# EAGLE design pico_1v4 (EAGLE 7.4.0)
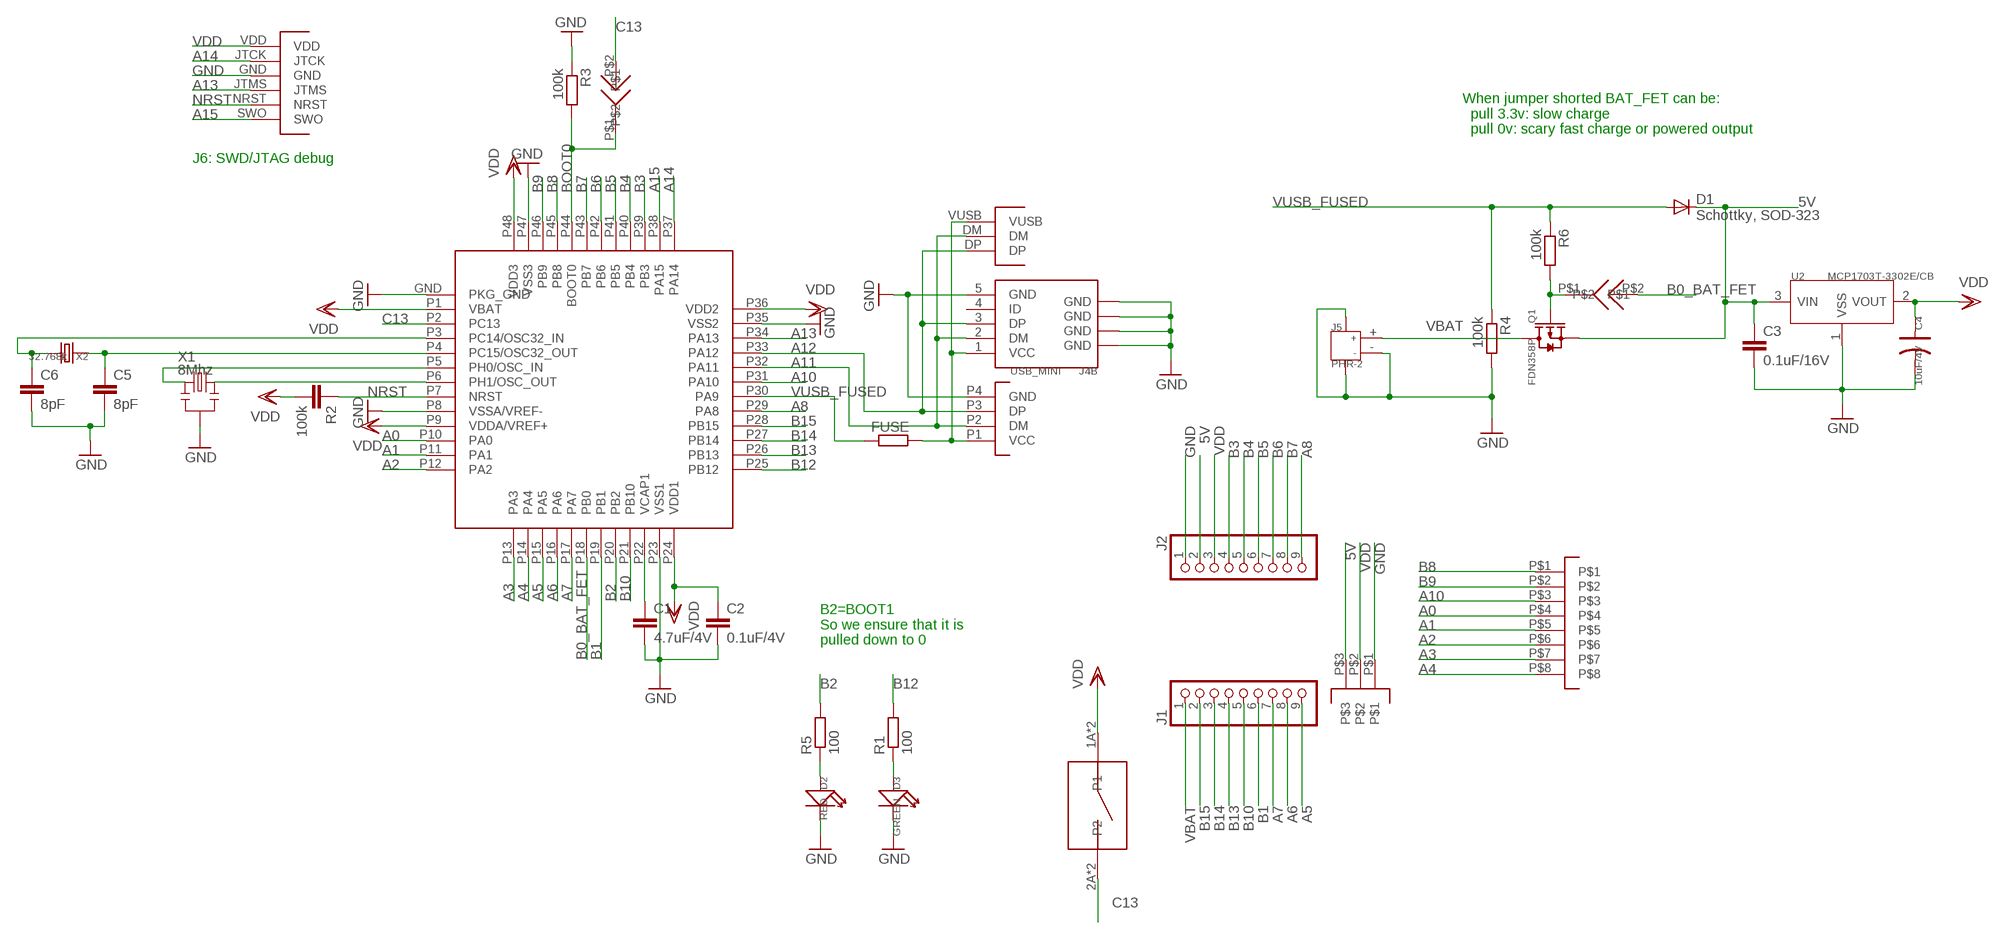
[diagram p0: schematic, sheet 1]

## Parts
B1  KMR421NG  [KMR421NG]
C1  4.7uF/4V  C0402  [C0402]
C2  0.1uF/4V  C0402  [C0402]
C3  0.1uF/16V  C0402  [C0402]
C4  10uF/4V  C-POLAR-A  [AVX-A]
C5  8pF  C0402  [C0402]
C6  8pF  C0402  [C0402]
D1  Schottky, SOD-323  DIODE-SOD323-W  [SOD323-W]
D2  RED  LED'0402'  [LED-0402]
D3  GREEN  LED'0402'  [LED-0402]
FUSE  R-EU_R0603  [R0603]
J1  PINHEAD9  [PINHEAD9]
J2  PINHEAD9  [PINHEAD9]
J3  SOLDERJUMPER  [SOLDERJUMPER]
J4A  USB_TYPE_A_ONBOARD  [USB_TYPEA_ONBOARD]
J4B  USB_MINI  [USB_MINI]
J5  PHR-2  JACK-JST-2P-SMD-PW'2.0'  [JST-SMD-2.0-90D]
J6  CON-SWD  [CON-SWD]
J7  SOLDERJUMPER  [SOLDERJUMPER]
J8  PINHEAD-1.27-8X1  [PINHEAD-1.27-8X1]
J9  PINHEAD-1.27-3X1  [PINHEAD-1.27-3X1]
Q1  FDN358P  MOSFET-P-0440210P1  [SOT23]
R1  100  R0402  [R0402]
R2  100k  C0402  [C0402]
R3  100k  R0402  [R0402]
R4  100k  R0402  [R0402]
R5  100  R0402  [R0402]
R6  100k  R0402  [R0402]
U1  STM32F401CDU6  STM32F401RCH  [UFQFPN48]
U2  MCP1703T-3302E/CB  XC6206  [SOT23]
U$1  USB  [USB]
X1  8Mhz  CRYSTAL-RESONATOR'SMD'  [3P-SMD-3.6X1.3]
X2  32.768k  CRYSTAL'NX2012SA'  [2P-SMD-2.05X1.2]

## Nets
5V: C3.1 D1.C J2.2 J9.P$3 Q1.2(S) U2.3(VIN)
A0: J8.P$4 U1.P10(PA0)
A1: J8.P$5 U1.P11(PA1)
A2: J8.P$6 U1.P12(PA2)
A3: J8.P$7 U1.P13(PA3)
A4: J8.P$8 U1.P14(PA4)
A5: J1.9 U1.P15(PA5)
A6: J1.8 U1.P16(PA6)
A7: J1.7 U1.P17(PA7)
A8: J2.9 U1.P29(PA8)
A10: J8.P$3 U1.P31(PA10)
A11: J4A.P2(DM) J4B.2(DM) U1.P32(PA11) U$1.DM
A12: J4A.P3(DP) J4B.3(DP) U1.P33(PA12) U$1.DP
A13: J6.JTMS U1.P34(PA13)
A14: J6.JTCK U1.P37(PA14)
A15: J6.SWO U1.P38(PA15)
B0_BAT_FET: J3.P$2 U1.P18(PB0)
B1: J1.6 U1.P19(PB1)
B2: R5.2 U1.P20(PB2)
B3: J2.4 U1.P39(PB3)
B4: J2.5 U1.P40(PB4)
B5: J2.6 U1.P41(PB5)
B6: J2.7 U1.P42(PB6)
B7: J2.8 U1.P43(PB7)
B8: J8.P$1 U1.P45(PB8)
B9: J8.P$2 U1.P46(PB9)
B10: J1.5 U1.P21(PB10)
B12: R1.2 U1.P25(PB12)
B13: J1.4 U1.P26(PB13)
B14: J1.3 U1.P27(PB14)
B15: J1.2 U1.P28(PB15)
BOOT0: J7.P$1 R3.2 U1.P44(BOOT0)
C13: B1.2A(P2) B1.2B(P2) J7.P$2 U1.P2(PC13)
GND: C1.3 C2.3 C3.3 C4.- C5.3 C6.3 D2.- D3.- J2.1 J4A.P4(GND) J4B.5(GND) J4B.P$1(GND) J4B.P$2(GND) J4B.P$3(GND) J4B.P$4(GND) J5.3 J5.4 J5.- J6.GND J9.P$1 R3.1 R4.2 U1.GND(PKG_GND) U1.P8(VSSA/VREF-) U1.P23(VSS1) U1.P35(VSS2) U1.P47(VSS3) U2.1(VSS) X1.2
N$1: C5.1 U1.P4(PC15/OSC32_OUT) X2.1
N$2: C6.1 U1.P3(PC14/OSC32_IN) X2.2
N$3: U1.P5(PH0/OSC_IN) X1.1
N$4: U1.P6(PH1/OSC_OUT) X1.3
N$5: D2.+ R5.1
N$7: D3.+ R1.1
N$8: J3.P$1 Q1.1(G) R6.2
N$40: C1.1 U1.P22(VCAP1)
NRST: J6.NRST R2.1 U1.P7(NRST)
VBAT: J1.1 J5.+ Q1.3(D)
VDD: B1.1A(P1) B1.1B(P1) C2.1 C4.+ J2.3 J6.VDD J9.P$2 R2.3 U1.P1(VBAT) U1.P9(VDDA/VREF+) U1.P24(VDD1) U1.P36(VDD2) U1.P48(VDD3) U2.2(VOUT)
VUSB: FUSE.2 J4A.P1(VCC) J4B.1(VCC) U$1.VUSB
VUSB_FUSED: D1.A FUSE.1 R4.1 R6.1 U1.P30(PA9)
Unconnected: J4B.4(ID)

## Notes on the sheet
- When jumper shorted BAT_FET can be:
    pull 3.3v: slow charge
    pull 0v: scary fast charge or powered output
- J6: SWD/JTAG debug
- B2=BOOT1
  So we ensure that it is
  pulled down to 0

## Library data of the parts
B1 = KMR421NG:KMR421NG
C1-C3 C5 C6 R2 = Discrete:C0402
C4 = OPL5:C-POLAR*
D1 = diode:DIODE-: DIODE
D2 D3 = Discrete:LED*
FUSE = rcl:R-EU_: RESISTOR, European symbol
J1 J2 = pinhead-espruino:PINHEAD9
J3 J7 = solder_jumper:SOLDERJUMPER
J4A = USB:USB_TYPE_A_ONBOARD
J4B = USB:USB_MINI
J5 = Connector:JACK-JST-2P-SMD-PW
J6 = swd:CON-SWD
J8 = pinhead-127:PINHEAD-1.27-8X1
J9 = pinhead-127:PINHEAD-1.27-3X1
Q1 = OPL5:MOSFET-P: CJ2305?SMD MOSFET P-CH 8V-4.1A
R1 R3-R6 = Discrete:R0402
U1 = ufqfpn48:STM32F401RCH
U2 = xc6206:XC6206
U$1 = testpoint:USB
X1 = Discrete:CRYSTAL-RESONATOR: Resonator Small SMD resonator. This is the itty bitty 10/20MHz resonators with built in caps. CSTCE10M0G55 and CSTCE20M0V53. Footprint has been reviewed closely but hasn't been tested yet.
X2 = Discrete:CRYSTAL*: CRYSTAL

## Board
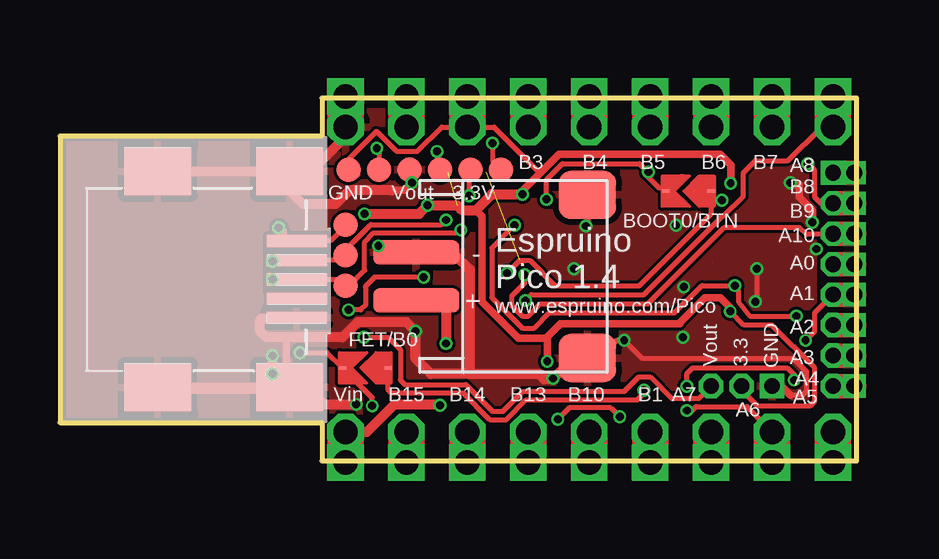
[diagram p1: board, top side]
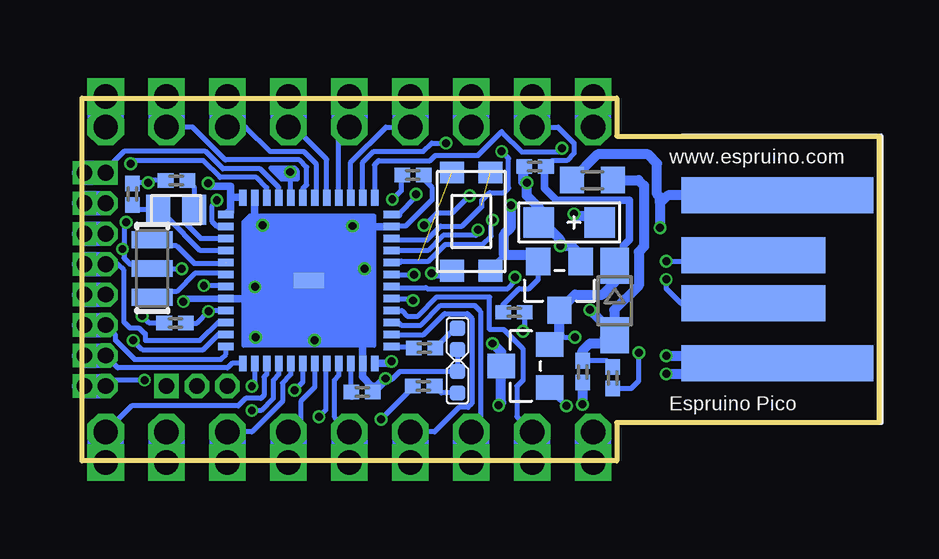
[diagram p2: board, bottom side, seen from below]

Size 33.21 x 15.11 mm. Coordinates in mm from the lower left corner, seen from the top.
Outline: 0,1.59 10.92,1.59 10.92,0 33.21,0 33.21,15.11 10.92,15.11 10.92,13.53 0,13.53 0,1.59
Copper layers (1*16): Top 0.035559375mm / dielectric 0.17018125mm / Bottom 0.035559375mm
Design rules "OSHPark-4layer *": minimum track width 5mil, minimum drill 10mil, track to track 5mil, track to pad 5mil, pad to pad 5mil, via to via 5mil, smd to smd 0mil, copper to edge 4mil, drill to drill 6mil, minimum pad ring 4mil, minimum via ring 4mil, stop-mask expansion 4mil, vias tented up to drill 15mil, thermal gap 10mil

### Footprints (pad centres in the part's own frame; a part is rotated, then mirrored left to right if it is on the bottom)
KMR421NG = smd 0.9 x 1: 1A -2.05,0.8; 1B 2.05,0.8; 2A -2.05,-0.8; 2B 2.05,-0.8
C0402 = smd 0.65 x 0.6: 1 -0.45,0; 3 0.45,0
AVX-A = smd 1.27 x 1.27: + -1.27,0; - 1.27,0
SOD323-W = smd 1.5 x 1.2: A 1.45,0; C -1.45,0
LED-0402 = smd 0.635 x 0.635: + -0.445,0; - 0.445,0
R0603 = smd 1 x 1.1: 1 -0.85,0; 2 0.85,0
PINHEAD9 = drill 1.016 octagon: 1 -8.89,0; 2 -6.35,0; 3 -3.81,0; 4 -1.27,0; 5 1.27,0; 6 3.81,0; 7 6.35,0; 8 8.89,0; 9 11.43,0
SOLDERJUMPER = smd 0.305 x 0.152: P$1 0.762,0; P$2 -1.143,0
USB_TYPEA_ONBOARD = smd 8 x 1.5: P1 -4,-3.5; P4 -4,3.5 | smd 6 x 1.5: P2 -3,-1; P3 -3,1
USB_MINI = smd 0.508 x 2.54: 1 -1.6,4.191; 2 -0.8,4.191; 3 0,4.191; 4 0.8,4.191; 5 1.6,4.191 | smd 2 x 2.794: P$1 4.5,-1.603; P$2 -4.5,-1.603; P$3 4.5,3.897; P$4 -4.5,3.897
JST-SMD-2.0-90D = smd 2 x 2.4: 3 3.4,-2.181; 4 -3.4,-2.181 | smd 1 x 3.6: + -1,4.953; - 1,4.953
CON-SWD = smd 1.016 x 1.016: GND -0.635,0; JTCK -1.905,0; JTMS 0.635,0; NRST 1.905,0; SWO 3.175,0; VDD -3.175,0
PINHEAD-1.27-8X1 = drill 0.65 pad 1.016 square: P$1 0,4.445 | drill 0.65 pad 1.016 octagon: P$2 0,3.175; P$3 0,1.905; P$4 0,0.635; P$5 0,-0.635; P$6 0,-1.905; P$7 0,-3.175; P$8 0,-4.445
PINHEAD-1.27-3X1 = drill 0.65 pad 1.016 square: P$1 0,1.27 | drill 0.65 pad 1.016 octagon: P$2 0,0; P$3 0,-1.27
SOT23 = smd 1.016 x 1.143: 1 -0.889,-1.016; 2 0.889,-1.016; 3 0,1.016
R0402 = smd 0.65 x 0.6: 1 -0.45,0; 2 0.45,0
UFQFPN48 = smd 1.27 x 0.635: GND 0,0 | smd 0.65 x 0.3: P1 -3.45,2.75; P2 -3.45,2.25; P3 -3.45,1.75; P4 -3.45,1.25; P5 -3.45,0.75; P6 -3.45,0.25; P7 -3.45,-0.25; P8 -3.45,-0.75; P9 -3.45,-1.25; P10 -3.45,-1.75; P11 -3.45,-2.25; P12 -3.45,-2.75; P25 3.45,-2.75; P26 3.45,-2.25; P27 3.45,-1.75; P28 3.45,-1.25; P29 3.45,-0.75; P30 3.45,-0.25; P31 3.45,0.25; P32 3.45,0.75; P33 3.45,1.25; P34 3.45,1.75; P35 3.45,2.25; P36 3.45,2.75 | smd 0.3 x 0.65: P13 -2.75,-3.45; P14 -2.25,-3.45; P15 -1.75,-3.45; P16 -1.25,-3.45; P17 -0.75,-3.45; P18 -0.25,-3.45; P19 0.25,-3.45; P20 0.75,-3.45; P21 1.25,-3.45; P22 1.75,-3.45; P23 2.25,-3.45; P24 2.75,-3.45; P37 2.75,3.45; P38 2.25,3.45; P39 1.75,3.45; P40 1.25,3.45; P41 0.75,3.45; P42 0.25,3.45; P43 -0.25,3.45; P44 -0.75,3.45; P45 -1.25,3.45; P46 -1.75,3.45; P47 -2.25,3.45; P48 -2.75,3.45
USB = smd 1.016 x 1.016: DM -0.635,0; DP 0.635,0; VUSB -1.905,0
3P-SMD-3.6X1.3 = smd 0.7 x 1.7: 1 -1.2,0; 2 0,0; 3 1.2,0
2P-SMD-2.05X1.2 = smd 1 x 1.25: 1 -0.75,0; 2 0.75,0

### Placement (x,y rotation side)
B1  16.99,9.97 270 bottom
C1  21.54,2.86 0 bottom
C2  15.21,6.19 0 bottom
C3  14.32,12.26 180 bottom
C4  12.9,9.93 180 bottom
C5  31.11,11.11 90 bottom
C6  29.27,11.68 180 bottom
D1  11.01,6.68 270 bottom
D2  17.56,3.27 90 bottom
D3  17.56,5.08 270 bottom
FUSE  11.94,11.7 180 bottom
J1  20.8,1.21 0 top
J2  20.8,13.91 0 top
J3  12.54,3.87 180 top
J4A  8.22,7.56 180 bottom
J4B  5.68,7.56 270 top
J5  19.81,7.68 90 top
J6  15.21,12.13 0 top
J7  26,11.24 180 top
J8  32.23,7.56 0 top
J9  28.42,3.11 270 top
Q1  14.73,3.95 90 bottom
R1  18.93,4.7 180 bottom
R2  29.34,5.74 0 bottom
R3  19.41,11.91 180 bottom
R4  12.34,3.72 270 bottom
R5  18.97,3.11 180 bottom
R6  11.09,3.47 270 bottom
U1  23.76,7.51 0 bottom
U2  13.31,7.29 180 bottom
U$1  11.91,7.94 270 top
X1  30.28,8.01 270 bottom
X2  29.29,10.46 0 bottom

### Tracks (layer width: path | path; a pad name or v marks a point on that pad's centre or on a via)
5V  (via drill 0.33, 1.02)
  Top 0.203: v12.67,5.14 13.68,5.14 14.19,4.64 14.19,3.37 14.38,3.17 16.92,3.17 18.03,2.06 18.48,2.06 19.3,2.89 23.53,2.89 24.13,3.49 24.61,3.49 25.5,2.6 26.64,2.6 J9.P$3
  Top 1.524: J2.2 v14.45,15.18
  Bottom 0.203: J2.2 13.37,13.91 12.7,13.24 12.7,12.81 13.01,12.51 13.62,12.51 C3.1 | Q1.2 13.43,4.84 | 13.23,4.84 13.43,4.84 | 13.43,4.84 13.43,5.14 v12.67,5.14
  Bottom 0.305: 10.64,8.75 10.64,8.95 10.38,9.21 10.38,10.86 13.43,10.86 13.94,11.37 13.94,12.26
  Bottom 0.406: Q1.2 13.31,5.24 U2.3 12.66,6.92 11.53,6.92 11.01,7.44 D1.C | 13.94,12.26 C3.1 | 10.64,8.75 11.01,8.38 D1.C | D1.C 11.14,8.27 11.14,8.39 | 11.16,8.38 11.14,8.39 | 11.14,8.39 11.14,8.45
  Bottom 1.524: J2.2 v14.45,15.18
A0  (via drill 0.65)
  Top 1.016: J8.P$4 v33.12,8.19
  Bottom 0.203: U1.P10 27.55,5.76 28.29,5.02 30.58,5.02 30.58,5.3 30.61,5.3 30.83,5.52 31.21,5.52 31.46,5.78 31.46,7.94 31.72,8.19 J8.P$4
  Bottom 1.016: v33.12,8.19 J8.P$4
A1  (via drill 0.33, 0.65)
  Top 0.203: v31.08,5.02 31.46,5.4 31.46,6.16 J8.P$5
  Top 1.016: J8.P$5 v33.12,6.92
  Bottom 0.203: U1.P11 27.54,5.26 28.16,4.64 30.7,4.64 v31.08,5.02
  Bottom 1.016: v33.12,6.92 J8.P$5
A2  (via drill 0.65)
  Top 1.016: J8.P$6 v33.12,5.65
  Bottom 0.203: U1.P12 27.21,4.45 27.43,4.23 31.03,4.23 31.81,5.02 31.81,5.24 J8.P$6
  Bottom 1.016: v33.12,5.65 J8.P$6
A3  (via drill 0.65)
  Top 1.016: J8.P$7 v33.12,4.38
  Bottom 0.203: U1.P13 26.96,4.06 27.15,3.87 31.72,3.87 J8.P$7
  Bottom 1.016: v33.12,4.38 J8.P$7
A4  (via drill 0.33, 0.65)
  Top 0.203: v26.13,3.11 26.13,3.62 26.38,3.87 30.32,3.87 30.61,3.59 v30.61,3.37
  Top 1.016: J8.P$8 v33.12,3.11
  Bottom 0.203: U1.P14 26.01,3.23 v26.13,3.11 | v30.61,3.37 31.97,3.37 J8.P$8
  Bottom 1.016: v33.12,3.11 J8.P$8
A5  (via drill 1.02)
  Top 1.524: J1.9 v32.23,-0.06
  Bottom 0.203: U1.P15 25.51,3.61 25.62,3.49 25.62,2.73 25.75,2.6 26.38,2.6 26.7,2.29 31.15,2.29 J1.9
  Bottom 1.524: J1.9 v32.23,-0.06
A6  (via drill 0.33, 1.02)
  Top 0.203: v26.13,2.1 26.35,2.1 26.51,2.25 28.64,2.25 J1.8
  Top 1.524: J1.8 v29.69,-0.06
  Bottom 0.203: U1.P16 25.01,3.6 25.24,3.37 25.24,2.6 25.75,2.1 v26.13,2.1
  Bottom 1.524: J1.8 v29.69,-0.06
A7  (via drill 1.02)
  Top 1.524: J1.7 v27.15,-0.06
  Bottom 0.203: U1.P17 24.51,3.59 24.86,3.24 24.86,2.48 26.13,1.21 J1.7
  Bottom 1.524: J1.7 v27.15,-0.06
A8  (via drill 0.33, 1.02)
  Top 0.203: v19.41,6.67 v19.41,6.68 19.65,6.92 24.35,6.92 27.65,10.22 27.69,10.22 28.48,11.02 28.48,12 28.99,12.51 30.35,12.51 31.75,13.91 J2.9
  Top 1.524: J2.9 v32.23,15.18
  Bottom 0.203: 20.27,6.72 U1.P29 19.49,6.76 v19.41,6.68
  Bottom 1.524: J2.9 v32.23,15.18
A10  (via drill 0.33, 0.65)
  Top 0.203: v19.37,7.75 19.37,7.4 18.83,6.86 18.83,6.48 19.27,6.03 19.53,6.03 20.03,6.54 24.51,6.54 27.69,9.72 30.83,9.72 31.12,9.43 32.23,9.43 J8.P$3
  Top 1.016: J8.P$3 v33.12,9.46
  Bottom 0.203: U1.P31 v19.38,7.76 v19.37,7.75
  Bottom 1.016: v33.12,9.46 J8.P$3
A11  (via drill 0.33)
  Top 0.203: J4B.2 9.11,8.36 | 10.38,8.38 10.15,8.38 | J4B.2 10.36,8.36 10.38,8.38 | 10.13,8.32 9.91,8.32 J4B.2 | 12.16,8.83 U$1.DM | U$1.DM 12.13,8.57 12.13,9.02 12.95,9.84 15.91,9.84 v16.1,10.03 | 10.38,8.38 11.72,8.38 U$1.DM
  Top 0.305: 8.84,8.33 v8.86,8.32 8.9,8.36 9.11,8.36 | 9.53,8.32 10.13,8.32
  Bottom 0.203: U1.P32 19.97,8.26 19.91,8.32 18.76,8.32 18.07,9.02 16.51,9.02 16.16,9.37 16.16,9.97 v16.1,10.03 | v8.86,8.32 5.24,8.32 5.24,8.56 J4A.P2
A12  (via drill 0.33)
  Top 0.203: v8.86,7.56 J4B.3 11.65,7.56 U$1.DP 12.07,7.3 12.7,7.94 12.7,9.11 13.08,9.49 16.58,9.49 v16.71,9.62
  Top 0.305: 8.73,7.68 v8.86,7.56
  Bottom 0.203: U1.P33 19.97,8.76 18.8,8.76 18.16,9.4 16.8,9.4 16.71,9.49 v16.71,9.62 | J4A.P3 5.24,6.56 5.24,6.54 8.22,6.54 8.86,7.18 v8.86,7.56
A13  (via drill 0.33)
  Top 0.203: v15.72,12.89 15.72,12.13 J6.JTMS
  Bottom 0.203: U1.P34 20.11,9.26 20.16,9.21 18.83,9.21 18.26,9.78 17.37,9.78 16.54,10.6 16.54,10.86 16.22,11.18 15.62,11.18 15.43,11.37 15.43,12.6 v15.72,12.89
A14  (via drill 0.33)
  Top 0.203: v13.21,13.02 13.3,12.92 J6.JTCK
  Top 0.406: 13.27,12.13 J6.JTCK
  Bottom 0.203: U1.P37 21.03,10.98 21.03,12.33 20.85,12.51 18.7,12.51 18.48,12.73 16.7,12.73 15.72,13.72 14.86,12.86 13.37,12.86 v13.21,13.02
A15  (via drill 0.33)
  Top 0.203: 18.26,12.26 J6.SWO 18.03,12.48 v18.03,13.24
  Bottom 0.203: U1.P38 21.51,12.43 21.05,12.89 18.99,12.89 18.64,13.24 v18.03,13.24
B0_BAT_FET  (via drill 0.33)
  Top 0.203: v24.35,2.94 24.32,2.91 24.32,2.79 24.07,2.54 19.43,2.54 18.61,1.71 17.91,1.71 16.8,2.83 13.81,2.83 13.68,2.95 J3.P$2
  Bottom 0.203: U1.P18 24.01,3.28 v24.35,2.94
B1  (via drill 1.02)
  Top 1.524: J1.6 v24.61,-0.06
  Bottom 0.203: U1.P19 23.51,3.07 24.1,2.48 24.1,1.71 J1.6
  Bottom 1.524: J1.6 v24.61,-0.06
B2  (via drill 0.33)
  Top 0.203: v23.34,1.84 22.97,2.21 21.23,2.21 v20.75,1.73
  Bottom 0.203: U1.P20 23.06,4.06 23.06,2.12 v23.34,1.84 | R5.2 19.42,3.06 v20.75,1.73
B3  (via drill 1.02)
  Top 1.524: J2.4 v19.53,15.18
  Bottom 0.203: U1.P39 22.01,12.44 20.54,13.91 J2.4
  Bottom 1.524: J2.4 v19.53,15.18
B4  (via drill 1.02)
  Top 1.524: J2.5 v22.07,15.18
  Bottom 0.203: U1.P40 22.51,13.46 J2.5
  Bottom 1.524: J2.5 v22.07,15.18
B5  (via drill 1.02)
  Top 1.524: J2.6 v24.61,15.18
  Bottom 0.203: U1.P41 23.01,12.56 24.35,13.91 J2.6
  Bottom 1.524: J2.6 v24.61,15.18
B6  (via drill 1.02)
  Top 1.524: J2.7 v27.15,15.18
  Bottom 0.203: U1.P42 23.46,11.01 23.46,12.38 23.97,12.89 25.37,12.89 26.38,13.91 J2.7
  Bottom 1.524: J2.7 v27.15,15.18
B7  (via drill 1.02)
  Top 1.524: J2.8 v29.69,15.18
  Bottom 0.203: U1.P43 24.01,11.33 23.84,11.49 23.84,12.24 24.15,12.54 27.24,12.54 28.61,13.91 J2.8
  Bottom 1.524: J2.8 v29.69,15.18
B8  (via drill 0.65)
  Top 1.016: J8.P$1 v33.12,12
  Bottom 0.203: U1.P45 25.01,11.39 25.78,12.16 27.34,12.16 28.07,12.89 31.46,12.89 32.23,12.13 J8.P$1 31.97,12.26 31.97,12.32
  Bottom 1.016: v33.12,12 J8.P$1
B9  (via drill 0.33, 0.65)
  Top 0.203: J8.P$2 31.72,10.73 31.46,10.99 31.46,12.1 v31.18,12.38
  Top 1.016: J8.P$2 v33.12,10.73
  Bottom 0.203: U1.P46 25.51,11.38 25.94,11.81 27.46,11.81 28.16,12.51 31.05,12.51 v31.18,12.38
  Bottom 1.016: v33.12,10.73 J8.P$2
B10  (via drill 1.02)
  Top 1.524: J1.5 v22.07,-0.06
  Bottom 0.203: U1.P21 22.51,3.56 22.7,3.37 22.7,1.84 J1.5
  Bottom 1.524: J1.5 v22.07,-0.06
B12
  Bottom 0.203: U1.P25 19.44,4.76 R1.2
B13  (via drill 1.02)
  Top 1.524: J1.4 v19.53,-0.06
  Bottom 0.203: U1.P26 18.97,5.26 18.1,6.13 17.15,6.13 16.95,5.94 16.95,2.38 17.11,2.22 17.49,2.22 18.51,1.21 J1.4
  Bottom 1.524: J1.4 v19.53,-0.06
B14  (via drill 1.02)
  Top 1.524: J1.3 v16.99,-0.06
  Bottom 0.203: U1.P27 20.02,5.76 19.91,5.65 19.08,5.65 18.26,6.48 16.86,6.48 16.61,6.22 16.61,1.59 J1.3
  Bottom 1.524: J1.3 v16.99,-0.06
B15  (via drill 1.02)
  Top 1.524: J1.2 v14.45,-0.06
  Bottom 0.203: U1.P28 19.88,6.26 19.65,6.03 19.21,6.03 18.42,6.83 16.22,6.83 16.22,5.46 15.62,5.46 14.83,4.67 14.83,3.37 15.08,3.11 15.08,1.84 J1.2
  Bottom 1.524: J1.2 v14.45,-0.06
BOOT0  (via drill 0.33)
  Top 0.152: 26,11.87 25.88,11.87 J7.P$1
  Top 0.203: v20.28,10.89 20.28,11.7 20.96,12.38 24.16,12.38 24.52,12.03 v24.52,12.03 v24.53,12.03 24.52,12.02 24.52,11.84 24.99,11.37 25.11,11.37 J7.P$1
  Bottom 0.203: U1.P44 24.51,11.77 24.52,11.77 24.52,12.02 v24.53,12.03 | 24.82,11.75 24.23,11.75 24.23,12.06 24.35,12.19 25.34,12.19 24.89,11.75 24.82,11.75 | 25.08,12.03 v24.53,12.03 | v24.53,12.03 24.38,12.03 24.38,11.91 24.89,11.91 | v24.53,12.03 24.53,11.91 24.52,11.9 | 24.82,11.75 v24.53,12.03 | R3.2 19.91,11.91 19.91,11.24 19.93,11.24 v20.28,10.89
C13  (via drill 0.33)  (1 unrouted)
  Top 0.203: v18.64,7.81 19.18,8.35 19.59,8.35 20.64,7.3 24.16,7.3 27.15,10.29 27.15,10.79 | 27.59,10.83 v27.59,10.86 27.21,10.86 27.15,10.79 | 27.15,11.18 J7.P$2 27.15,10.79
  Bottom 0.203: U1.P2 27.57,9.76 27.78,9.97 27.78,10.64 27.59,10.83 v27.59,10.86 | B1.2B 17.79,7.68 18.51,7.68 v18.64,7.81
GND  (via drill 0.33, 1.02)
  Top 0.203: 16.48,8.57 14.96,8.57 J5.- | J5.4 22.91,4.28 22.96,4.33 22.96,4.76 23.22,5.02 v23.52,5.02 24.29,4.25 30.58,4.25 31.12,3.71 31.12,2.89 30.96,2.73 30.45,2.73 | 20.42,3.44 20.42,3.49 | v29.05,8 29.05,6.73 28.99,6.67 v28.99,6.64 | 30.07,3.11 J9.P$1 | J5.3 21.99,9.84 v21.93,9.79 | 9.87,12 9.37,12 9.42,12.06 J4B.P$4 9.82,12.06 9.87,12 | 9.87,12 10.41,12 10.48,12.06 | J4B.P$1 3.96,3.06 3.65,3.37 | 9.87,12.13 9.87,12 | 9.87,12 10,12.13 10,12 9.87,11.87 9.87,12 | J6.GND 14.57,12
  Top 0.305: 9.87,12.06 | 9.87,12.06 9.87,12.13 | 9.87,12.06 9.87,12 | 9.43,5.14 9.43,3.05 | v31.37,9.94 31.37,10.45 30.83,10.99 30.83,11.49 30.54,11.49 v30.45,11.59 | 30.45,2.73 30.07,3.11 | 13.84,11.27 14.35,11.27 v14.67,11.59
  Top 0.406: 14.84,8.7 J5.- | J5.4 21.41,4.28 v20.56,3.43 | 8.95,2.98 3.65,2.98 3.65,3.37 | 9.37,12 9.37,11.96 | 10.48,12.06 11.91,13.49 J2.1 | J4B.P$1 J4B.P$3 10.31,3.06 | v8.86,3.62 8.89,3.62 8.89,3.05 8.95,2.98 | 8.86,3.05 v8.86,4.38 | 13.84,11.27 12.07,11.27 11.49,10.7 10.13,10.7 9.58,11.25 J4B.P$4 J4B.P$2 | 17.08,3.62 15.46,3.62 14.83,4.25 v14.83,5.4 14.45,5.78 12.41,5.78 11.78,5.14 9.43,5.14 8.6,5.14 8.35,5.4 8.35,5.87 8.41,5.94 10.11,5.94 | 16.48,8.57 17.05,8 17.08,8 17.08,3.62 | 10.31,3.06 11.02,2.35 v12.35,2.35 | 9.43,3.05 10.26,3.05 10.26,3.24 10.31,3.18 10.31,3.06 | 20.49,3.4 20.19,3.4 19.97,3.62 17.08,3.62 | 9.11,2.98 8.95,2.98
  Top 1.524: v11.91,15.18 J2.1
  Bottom 0.203: 26.13,6.76 24.51,6.76 24.48,6.79 U1.GND 21.92,5.67 21.6,5.35 | 29.04,8.01 X1.2 30.46,8.19 31.21,8.19 31.46,8.45 31.46,9.84 v31.37,9.94 | U1.P35 20.29,9.78 19.72,9.78 18.61,10.89 18.61,11.37 18.96,11.73 R3.1 18.96,11.78 18.98,11.78 | 22.19,9.08 21.96,9.31 21.96,9.76 21.96,9.79 v21.93,9.79 | 26.13,6.76 26.26,6.76 | 26.01,9.76 26.07,9.82 | 28.93,8.01 29.04,8.01 | 29.04,8.01 v29.05,8 | 28.86,6.76 v28.98,6.64 v28.99,6.64 | 26.07,9.82 | 26.07,9.82 v25.69,9.82 26,9.5 v26,7.25 26,6.89 26.13,6.76 | v25.97,5.15 25.97,6.6 26,6.63 | v21.43,8 21.43,8.06 22.32,8.95 | 14.13,10.19 14.16,10.22 | C6.3 30.35,11.68 v30.45,11.59 31.08,11.59 C5.3 | D3.- D2.- 17.56,3.68 17.59,3.71 19.97,3.71 20.29,3.4 20.52,3.4 v20.56,3.43 | C2.3 14.76,5.47 v14.83,5.4 | 14.13,10.01 14.17,10.01 C4.- 14.19,9.93 | 18.98,11.78 18.89,11.87 | v14.67,11.59 14.8,11.59 14.83,11.62 | 19,11.78 18.98,11.78 | 20.96,3.03 21.09,2.9 C1.3
  Bottom 0.279: U1.P8 28.86,6.76
  Bottom 0.305: U1.P47 26.01,9.76 | 26,6.63 26.13,6.76 | 21.43,6.16 21.92,5.67 | 21,3.1 21.14,3.1 21.53,3.49 21.53,3.52 21.51,3.54 U1.P23 21.51,5.26 21.6,5.35 | U1.P8 26.26,6.76 | 23.74,6.06 24.48,6.79 | U1.P35 21.96,9.76 | 13.81,9.93 14.19,9.93 | 14.13,10.19 14.13,10.01
  Bottom 0.406: 22.19,9.08 22.32,8.95 U1.GND | 21.96,10.07 21.96,9.76 | v8.86,3.62 4.22,3.62 J4A.P4 | v8.86,4.38 4.79,4.38 4.79,4.13 4.67,4 | 14.16,10.22 14.16,10.54 14.67,11.05 v14.67,11.59 | R4.2 v12.34,2.36 v12.35,2.35 | v20.56,3.43 20.96,3.03 | C3.3 14.83,12.26 14.83,11.62 | 13.81,9.93 13.81,9.75 13.27,9.21 v13.27,8.95 12.81,8.95 12.42,8.56 U2.1
  Bottom 1.524: v11.91,15.18 J2.1
  other vias: 31.53,8.83
  pour Top: -0.54,14.54 31.34,14.54 31.46,0.57 -0.41,0.44
N$1
  Bottom 0.203: U1.P4 28.29,8.76 29.62,10.1 29.67,10.1 X2.1 30.86,10.46 31.06,10.66 C5.1
N$2
  Bottom 0.203: U1.P3 28.25,9.26 28.89,9.9 28.89,10.11 X2.2 28.54,11.4 C6.1
N$3  (1 unrouted)
  Bottom 0.203: U1.P5 27.21,8.22 | X1.1 30.03,8.95 29.27,8.95 28.54,8.23 27.24,8.23 U1.P5
N$4
  Bottom 0.203: 27.19,7.81 27.26,7.81 | X1.3 30.04,7.05 29.27,7.05 28.51,7.81 27.27,7.81 27.26,7.81 | U1.P6 27.26,7.81
N$5
  Bottom 0.203: D2.+ 18.23,2.83 R5.1
N$7
  Bottom 0.203: D3.+ 17.66,5.52 R1.1
N$8  (via drill 0.33)
  Top 0.203: 11.91,3.75 J3.P$1 | v13.02,2.29 13.02,2.64 J3.P$1 | v10,4.51 11.14,4.51 J3.P$1
  Bottom 0.203: 13.48,3.06 Q1.1 13.58,3.06 | 11.08,2.95 11.08,2.82 11.09,2.83 R6.2 | 11.09,2.98 R6.2 | 13.48,3.06 13.48,3.19 | 13.48,3.06 13.48,2.91 | 13.56,2.91 13.56,2.83 13.51,2.78 v13.02,2.29 | R6.2 10.32,3.02 10,3.33 v10,4.51
  Bottom 0.406: 13.48,2.91 13.51,2.91 13.51,2.78
N$40
  Bottom 0.203: U1.P22 22.01,2.86 | 22.01,2.86 22.01,2.66 21.91,2.66 21.91,2.69 | C1.1 22.01,2.86
NRST  (via drill 0.33)
  Top 0.203: J6.NRST 16.73,12.13 17.05,11.81 v17.05,11.05 | v18.96,9.81 18,8.86 18,6.79 19.27,5.52 19.78,5.52 20.42,6.16 25.62,6.16 26.77,7.3 v28.13,7.3 28.13,7.24 28.29,7.08 28.29,6.64 28.77,6.03 v30.7,6.03
  Bottom 0.203: U1.P7 27.21,7.3 v28.13,7.3 | v17.05,11.05 17.78,10.32 18.42,10.32 18.89,9.84 18.96,9.84 v18.96,9.81 | R2.1 30.41,5.74 v30.7,6.03
VBAT  (via drill 0.33, 1.02)
  Top 0.406: 16.1,6.65 16.1,6.54 | 16.1,6.54 v16.1,4.89 | J1.1 12.8,1.21 13.94,2.35 15.72,2.35 15.75,2.32 v15.84,2.32 | J5.+ 15,6.54 16.1,6.54
  Top 1.524: J1.1 v11.91,-0.06
  Bottom 0.406: v15.84,2.32 15.74,2.42 Q1.3 15.74,4.53 v16.1,4.89
  Bottom 1.524: J1.1 v11.91,-0.06
VDD  (via drill 0.33, 1.02)  (1 unrouted)
  Top 0.203: 12.03,12.26 J6.VDD | 12.41,11.91 12.07,11.91 12.03,11.87 J6.VDD | J9.P$2 28.42,2.95 29.08,2.29 31.27,2.29 31.46,2.48 31.46,3.87 29.69,5.65 28.51,5.65 v27.94,6.22 | J6.VDD 12.03,12.57 13.18,13.72 13.21,13.72 14.04,12.89 14.89,12.89 15.91,13.91 J2.3 18.1,13.91 20.03,11.97 20.03,12
  Top 0.305: v20.31,4.14 20.31,5.05 20.32,5.05 20.26,5.11 | 20.26,5.11 19.11,5.11 17.59,6.64 17.59,10.19 17.34,10.45 | 20.26,5.11 20.86,5.71 25.84,5.71 25.84,5.75 26.89,6.79 27.53,6.79 27.94,6.38 v27.94,6.22 27.94,6.16 | v27.96,11.57 27.96,12.33 27.53,12.76 20.8,12.76 20.03,12 19.29,11.25 v19.29,11.11
  Top 0.406: v12.7,10.29 14.97,10.29 v15.33,10.64 16.57,10.64 16.76,10.45 17.34,10.45 18,11.11 v19.29,11.11
  Top 1.524: J2.3 v16.99,15.18
  Bottom 0.203: U1.P1 27.21,10.29 | U1.P9 27.94,6.26 v27.94,6.23 v27.94,6.22 28.42,5.74 R2.3 | 15.61,8.57 16.19,8 B1.1B | 11.3,10.48 11.3,10.42 11.4,10.32 | C2.1 15.66,6.5 14.99,7.18 14.57,7.18 14.19,7.56 U2.2 14.21,8.32 14.21,8.57 | 11.43,10.29 11.46,10.29 11.53,10.22 11.53,10.1 11.65,9.97 | 11.65,9.97 11.4,9.97 11.4,10.1 11.14,10.35 | C4.+ 11.65,9.93 11.65,9.97 | 20.02,10.26 19.29,10.99 v19.29,11.11
  Bottom 0.305: U1.P36 20.02,10.26 | U1.P24 20.39,4.06 v20.31,4.14 | U1.P48 26.54,10.99 27.02,10.99 | 27.02,10.99 27.02,11.43 27.82,11.43 v27.96,11.57 | 27.02,10.99 27.02,10.35 27.12,10.35 U1.P1
  Bottom 0.406: 14.21,8.57 15.61,8.57 15.61,9.44 15.34,9.72 v15.34,10.64 v15.33,10.64 | C4.+ 11.97,9.93 12.23,10.19 12.6,10.19 v12.7,10.29 | 11.66,10.06 11.43,10.29 11.4,10.32
  Bottom 1.524: J2.3 v16.99,15.18
VUSB  (via drill 0.33)
  Top 0.203: 9.27,9.14 9.56,9.14 9.54,9.16 J4B.1 9.89,9.18 11.27,9.18 11.91,9.81 U$1.VUSB
  Top 0.305: 8.76,9.14 9.27,9.14
  Top 0.406: 9.27,9.14 9.27,9.56 v9.11,9.72
  Bottom 0.406: 9.11,10.73 8.79,11.06 J4A.P1 | 9.11,10.73 v9.11,9.72 | 9.11,10.73 9.11,10.99 9.24,11.11 9.24,12.38 9.62,12.76 11.72,12.76 FUSE.2
VUSB_FUSED  (via drill 0.33)
  Top 0.203: 14.99,7.68 14.95,7.65 | 14.95,7.65 v15.16,7.65 | 14.95,7.65 13.11,7.65 12.73,7.27 12.73,6.48 12.54,6.29 v12.03,6.29
  Bottom 0.203: 11.47,5.14 11.53,5.14 | v15.16,7.65 15.15,7.63 15.15,7.49 15.46,7.18 18.83,7.18 18.87,7.22 20.21,7.22 20.25,7.26 U1.P30 | R6.1 11.35,4.17 R4.1 | 11.53,5.78 11.02,5.78 | 11.02,5.49 11.01,5.49 D1.A 11.47,5.23 11.47,5.14 | 11.47,5.14 10.76,5.14 10.76,5.02 10.89,5.02 10.89,4.89 11.6,4.89
  Bottom 0.406: R4.1 12.34,4.58 12.03,4.89 11.6,4.89 | 11.53,5.78 v12.03,6.29 | 11.02,5.49 11.02,5.78 11.02,6.29 10,7.3 10,8.7 9.78,8.92 9.78,11.46 10.01,11.7 FUSE.1

### Text on the board
tNames: B3 | B4 | B5 | B6 | B7 | A8 | B8 | GND | Vout | 3.3V | B9 | BOOT0/BTN | A10 | - | A0 | + | Espruino / Pico 1.4 | A1 | www.espruino.com/Pico | A2 | FET/B0 | Vout | 3.3 | GND | A3 | A4 | A5 | Vin | B15 | B14 | B13 | B10 | B1 | A7 | A6
bNames: www.espruino.com | Espruino Pico
bNames2: C3 | C5 | FUSE | R3 | C6 | X2 | C4 | B1 | U2 | X1 | D1 | C2 | R2 | D3 | R1 | R6 | R4 | Q1 | R5 | D2 | C1